# Altium schematic sheet Sheet1.SchDoc
size 228 x 215 mm; SheetNumber: 1; SheetTotal: 1
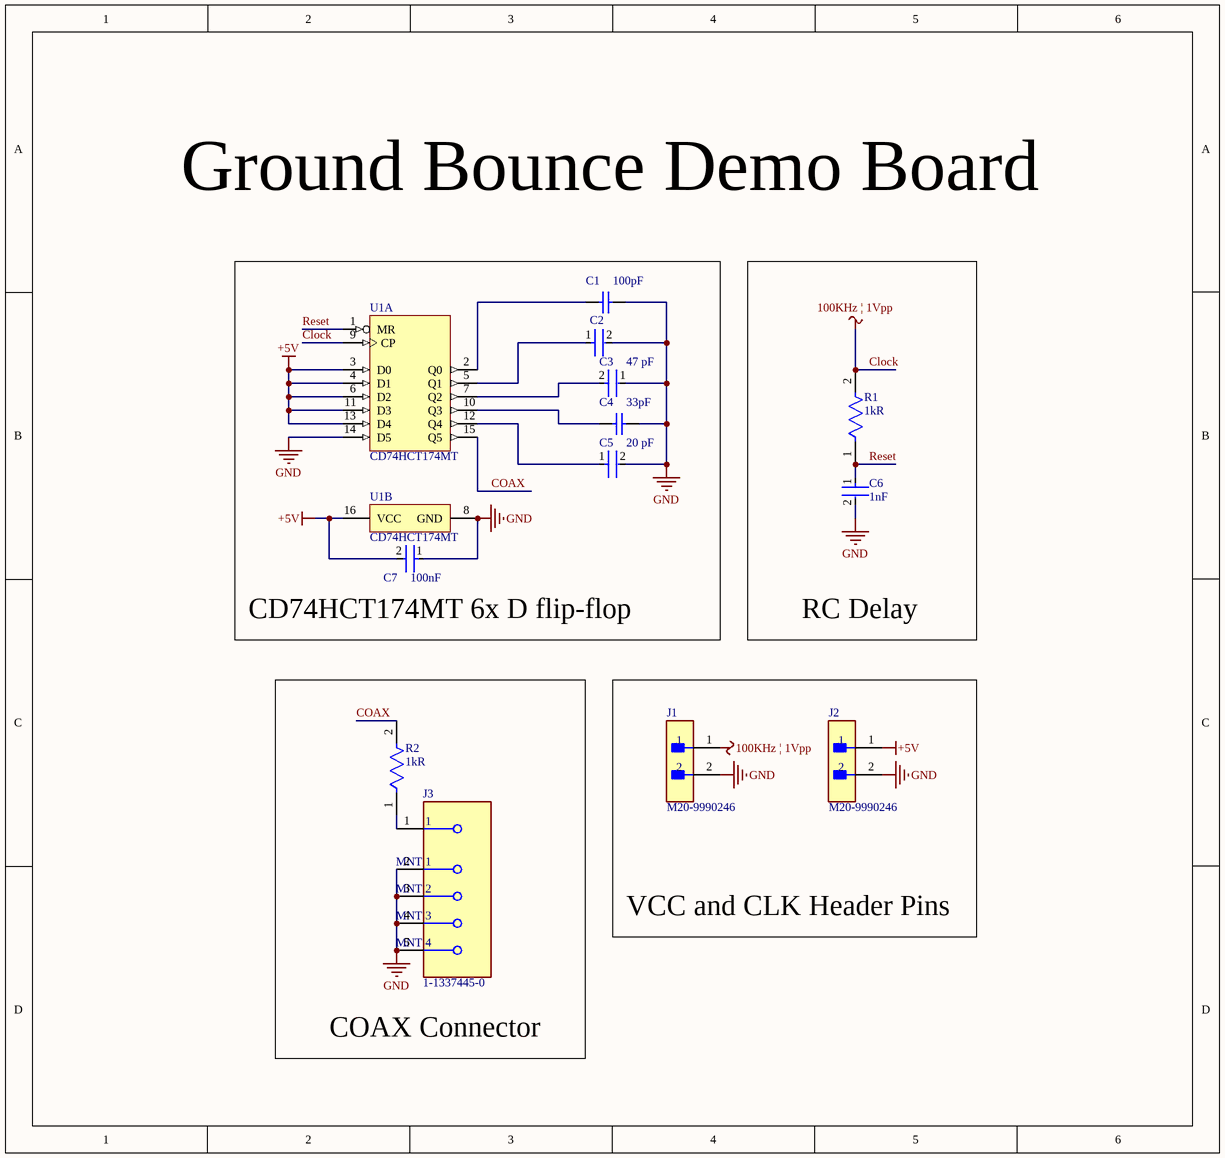
[diagram p0: Sheet1.SchDoc]

## Parts
C1  Parameter 1: 100pF  [CAPC1005X56X25NL10T15]  (hidden comment: 0402YC101JAT2A)
C2  CL05C750JB5NNNC  [FP-CL794-IPC_C]  (value not drawn)
C3  value 47 pF  [FP-CBR04C-MFG]  (hidden comment: CBR04C470F3GAC)
C4  Parameter 1: 33pF  [CAPC1005X55X30ML05T10]  (hidden comment: C0402T330J3GACTU)
C5  Capacitance: 20 pF  [FP-C0402-BB-MFG]  (hidden comment: C0402C200J3GACTU)
C6  Capacitance: 1nF  [FP-C1005-050-0_05-IPC_C]  (hidden comment: C1005X7R1V104K050BB)
C7  Capacitance: 100nF  [FP-C1005-050-0_05-IPC_C]  (hidden comment: C1005X7R1V104K050BB)
J1  M20-9990246  [FP-M20-9990246-MFG]
J2  M20-9990246  [FP-M20-9990246-MFG]
J3  1-1337445-0  [FP-1-1337445-0-MFG]
R1  Resistance: 1kR  [FP-MCS0402-IPC_B]  (hidden comment: MCS0402MD1002BE100)
R2  Resistance: 1kR  [FP-RC1005-IPC_A]  (hidden comment: RC1005F102CS)
U1  CD74HCT174MT  [D0016A_L]  (parts A,B of 2)

## Blocks framed on the sheet
CD74HCT174MT 6x D flip-flop: C1-C5 C7 U1
RC Delay: C6 R1
COAX Connector: J3 R2
VCC and CLK Header Pins: J1 J2

## Nets
+5V: C7.2 J2.1 U1.3(D0) U1.4(D1) U1.6(D2) U1.11(D3) U1.13(D4) U1.16(VCC)
Clock: J1.1 R1.2 U1.9(CP)  [also labelled 100KHz | 1Vpp]
GND: C1.2 C2.2 C3.1 C4.2 C5.2 C6.2 C7.1 J1.2 J2.2 J3.2(MNT_1) J3.3(MNT_2) J3.4(MNT_3) J3.5(MNT_4) U1.8(GND) U1.14(D5)
COAX: R2.2 U1.15(Q5)
Reset: C6.1 R1.1 U1.1(MR)
NetC1_1: C1.1 U1.2(Q0)
NetC2_1: C2.1 U1.5(Q1)
NetC3_2: C3.2 U1.7(Q2)
NetC4_1: C4.1 U1.10(Q3)
NetC5_1: C5.1 U1.12(Q4)
NetJ3_1: J3.1 R2.1

## Notes on the sheet
- Ground Bounce Demo Board

## Library data of the parts
C1 = CMP-2008-02792-1: Manufacturer: AVX Interconnect / Elco; Part Number: 0402YC101JAT2A
C2 = CMP-13271-003845-1: Cap Ceramic 75pF 50V C0G ±5% SMD 0402 +125°C Paper T/R; Capacitance: 75pF; Packaging: Tape and Reel; Min Operating Temperature: -55°C; Max Operating Temperature: 125°C; Dielectric: C0G; Depth: 0.5mm; Case Code (Metric): 1005; Height: 0.5mm; Radiation Hardening: No; Thickness: 0.022inch; Voltage Rating (DC): 50V; Voltage Rating: 50V; Tolerance: 5%; Width: 0.02inch; Length: 1mm; Case/Package: 0402; Mount: Surface Mount; Case Code (Imperial): 0402
C3 = CMP-03020-018522-1: CAP CER 47PF 25V C0G/NP0 0402; Manufacturer: KEMET; Temperature Characteristic: C0G; Temperature Coefficient: 30ppm/°C; Tolerance: 0.01; Material: Ceramic; ComponentLink2Description: Datasheet; Capacitance: 47 pF; Voltage Rating: 25 V; Device Class L3: Ceramic Capacitors; ComponentLink2URL: https://content.kemet.com/datasheets/KEM_C1030_CBR_SMD.pdf; RoHS: TRUE; Height: 0.55mm; Octopart: https://octopart.com/cbr04c470f3gac-kemet-30609232; Ipc Land Pattern Name: CAPC10050X50; Temperature Range High: +125°C; Device Class L2: Capacitors; Mouser Description: Cap Ceramic 47pF 25V C0G 1% SMD 0402 125°C Punched Paper T/R; Lead Free: Yes; Package: CBR04C; Temperature: -55°C to +125°C; Temperature Range Low: -55°C; Manufacturer Part Number: CBR04C470F3GAC; Digikey Description: CAP CER 47PF 25V C0G/NP0 0402; Device Class L1: Passive Components; Automotive: No; Category: Cap
C4 = CMP-2008-03465-1: Manufacturer: Kemet; Part Number: C0402T330J3GACTU
C5 = CMP-1034-00885-3: CAP CER 20PF 25V NP0 0402; Manufacturer: Kemet; Temperature Characteristic: C0G; Material: Ceramic; Tolerance: 0.05; Temperature Coefficient: 15%; Voltage Rating: 25 V; Temperature Range Low: -55°C; Category: Cap; Manufacturer Part Number: C0402C200J3GACTU; Package: C0402-BB; Automotive: No; Height: 0.55mm; Value: 20 pF; Device Class L1: Passive Components; Octopart: https://octopart.com/c0402c200j3gactu-kemet-14400860; RoHS: TRUE; Temperature: -55°C to +125°C; Device Class L2: Capacitors; Lead Free: Yes; Temperature Range High: +125°C; Digikey Description: CAP CER 20PF 25V NP0 0402; ComponentLink2URL: https://content.kemet.com/datasheets/KEM_C1002_X7R_SMD.pdf; Device Class L3: Ceramic Capacitors; ComponentLink2Description: Datasheet; Ipc Land Pattern Name: CAPC10050X50; Mouser Description: Capacitor, Ceramic, 20Pf, 25Vdc, 5-% Tol, 5+% Tol, C0g-Tc Code, -30, 30Ppm-Tc Rohs Compliant: Yes
C6 C7 = CMP-08246-006246-1: Multilayer Ceramic Capacitors 100nF ±10% 35V X7R SMD 0402; Dissipation Factor: 5%; Voltage Rating: 35V; Max Operating Temperature: 125°C; REACH SVHC: No SVHC; Mount: Surface Mount; Construction: Flat; Series: C; RoHS Compliant: Yes; Dielectric Material: Ceramic; Case Code (Imperial): 0402; Voltage: 35V; Lead Free: Lead Free; Width: 0.02inch; Case Code (Metric): 1005; Voltage Rating (DC): 35V; Package Quantity: 1; Case/Package: 0402; Weight: 2.3E-05oz; Height: 0.5mm; Dielectric: X7R; Tolerance: 10%; Depth: 0.5mm; Length: 1mm; Thickness: 0.022inch; Packaging: Tape and Reel; Termination: SMD/SMT; Min Operating Temperature: -55°C
J1 J2 = CMP-15831-000009-1: CONN HEADER VERT 2POS 2.54MM; Manufacturer: Harwin; Conn Gender: Male; Conn Orientation: Vertical; Number Of Contacts: 2; Current Rating: 3A; ComponentLink2URL: https://cdn.harwin.com/pdfs/M20-999.pdf; ComponentLink2Description: Datasheet; Package: M20-9990246; Temperature: -40°C to +105°C; Octopart: https://octopart.com/m20-9990246-harwin-2590635; Mouser Description: 2.54mm (0.1") Pitch SIL Vertical PC Tail Pin Header, 6.1mm mating pin height, tin, 2 contacts; Temperature Range High: +105°C; Device Class L1: Connectors; RoHS: TRUE; Automotive: No; Height: 8.99mm; Number Of Rows: 1; Contact Material: Tin,Nickel; Category: Conn; Pitch: 2.54mm; Lead Free: Yes; Digikey Description: CONN HEADER VERT 2POS 2.54MM; Manufacturer Part Number: M20-9990246; Temperature Range Low: -40°C; Device Class L3: unset; Device Class L2: Headers and Wire Housings
J3 = CMP-03357-000006-1: CONN BNC JACK STR 50 OHM PCB; PCB Mount Retention: With; Operating Frequency: 0 to 4Hz; PCB Mounting Orientation: Vertical; PCB Thickness: 0.126inch; Body Plating: Silver; Frequency: 4GHz; Impedance: 50R; Insulation Resistance: 5GR; Body Material: Brass; Dielectric Material: PTFE; Gender: Female; Sealable: No (Without); Number of Positions: 1; Orientation: Straight; RoHS Compliant: Yes; Min Operating Temperature: -65°C; Packaging: Bag; Fastening Type: Bayonet; Radiation Hardening: No; Max Frequency: 4GHz; Material: Brass; Contact Plating: Silver; ELV: Compliant; Depth: 12mm; Series: BNC; Package Quantity: 50; Connector Type: BNC; Contact Material: Brass; Max Operating Temperature: 165°C; Length: 12mm; Termination: Solder; Mount: Through Hole; Insulation Material: Polytetrafluoroethylene
R1 = CMP-02407-001558-1: RES SMD 1.2K OHM 1% 1/10W 0402; Tolerance: 0.1%; Temperature Coefficient: 25ppm/°C; Power Rating: 63mW; Voltage Rating: 50V; Height: 0.32mm; Lead Free: Lead Free; Max Operating Temperature: 155°C; Width: 0.5mm; Case Code (Metric): 1005; Composition: Thin Film; Case/Package: 0402; Length: 1mm; Weight: 2.1E-05oz; Case Code (Imperial): 0402; Contact Plating: Tin; Packaging: Tape and Reel; Min Operating Temperature: -55°C
R2 = CMP-13261-004451-1: Res Thick Film 0402 1kΩ 1% 0.063W ±100ppm/°C Molded SMD T/R; Voltage Rating (DC): 50V; Max Power Dissipation: 63mW; Composition: Thick Film; Lead Free: Lead Free; Max Operating Temperature: 155°C; Height: 0.016inch; Number of Terminations: 2; Features: Moisture Resistant; Min Operating Temperature: -55°C; Temperature Coefficient: 100ppm/°C; Case Code (Imperial): 0402; Radiation Hardening: No; Military Standard: Not; Depth: 0.5mm; Tolerance: 1%; Case/Package: 0402; Case Code (Metric): 1005; Packaging: Tape and Reel; Length: 1mm; Width: 0.02inch; Contact Plating: Tin
U1 = CMP-1619-00076-2: High Speed CMOS Logic Hex D-Type Flip-Flop with Reset, D0016A, SMALL T&R; Manufacturer: Texas Instruments; Bits(#): 6; 3-State Output: No; Input Type: TTL; F @ Nom Voltage(Max)(Mhz): 25; Voltage(Nom)(V): 5; VCC(Max)(V): 5.5; VCC(Min)(V): 4.5; Rating: Catalog; ICC @ Nom Voltage(Max)(mA): 0.08; Output Logic: Non-inverted; tpd @ Nom Voltage(Max)(ns): 50; Output Drive (IOL/IOH)(Max)(mA): 4/-4; Technology Family: HCT; DatasheetVersion: SCHS159C; Output Type: CMOS; Generic Part Number: CD74HCT174; PackageReference: D0016A; Schmitt Trigger: No; Code_JEDEC: MS-012 variation AC; Operating Temperature Range(C): -55 to 125